# Altium schematic sheet FDC.SchDoc
size A3; SheetNumber: 5; SheetTotal: 15
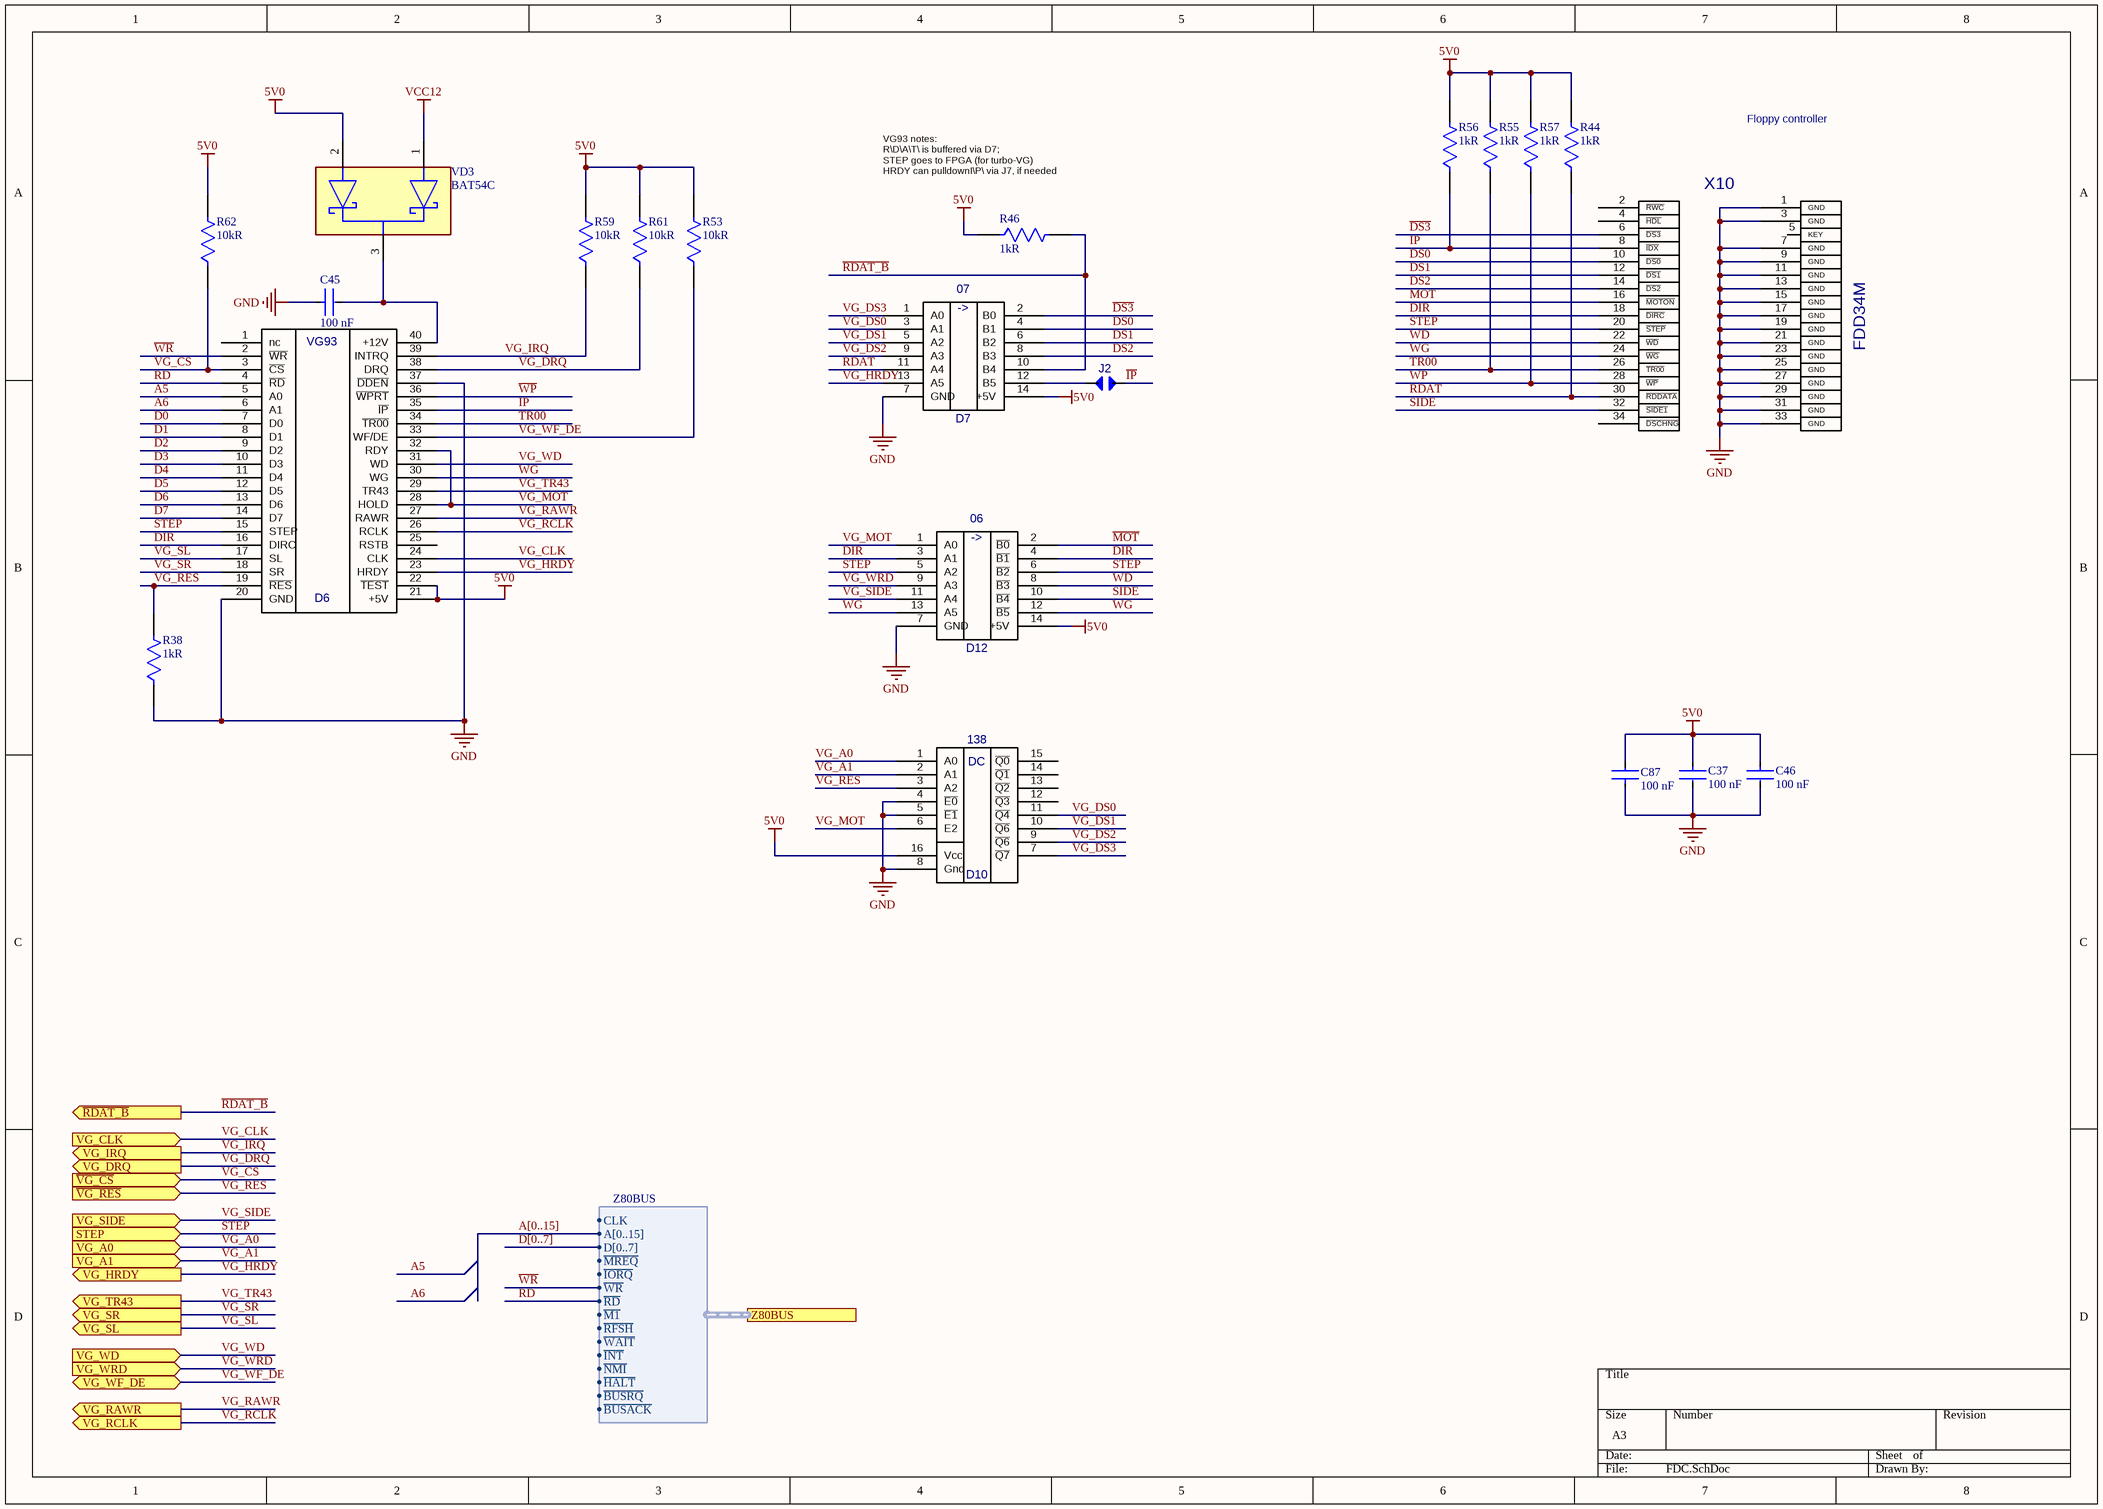
[diagram p0: FDC.SchDoc]

## Parts
C37  Capacitance: 100 nF  [FP-CC0805-0_85-IPC_A]  (hidden comment: CC0805KRX7R9BB104)
C45  Capacitance: 100 nF  [FP-CC0805-0_85-IPC_A]  (hidden comment: CC0805KRX7R9BB104)
C46  Capacitance: 100 nF  [FP-CC0805-0_85-IPC_A]  (hidden comment: CC0805KRX7R9BB104)
C87  Capacitance: 100 nF  [FP-CC0805-0_85-IPC_A]  (hidden comment: CC0805KRX7R9BB104)
D6  KR1818VG93  [DIP40]  (value not drawn)
D7  07  [SO14]
D10  138  [SO16]
D12  06  [SO14]
J2  JUMPER  [JUMPER_JUMPER(Primary)]  (value not drawn)
R38  Resistance: 1kR  [FP-CRCW0805-HPe3-IPC_A]  (hidden comment: CRCW08051K00FKEAHP)
R44  Resistance: 1kR  [FP-CRCW0805-HPe3-IPC_A]  (hidden comment: CRCW08051K00FKEAHP)
R46  Resistance: 1kR  [FP-CRCW0805-HPe3-IPC_A]  (hidden comment: CRCW08051K00FKEAHP)
R53  Resistance: 10kR  [FP-CR0805-IPC_A]  (hidden comment: CR0805-JW-103ELF)
R55  Resistance: 1kR  [FP-CRCW0805-HPe3-IPC_A]  (hidden comment: CRCW08051K00FKEAHP)
R56  Resistance: 1kR  [FP-CRCW0805-HPe3-IPC_A]  (hidden comment: CRCW08051K00FKEAHP)
R57  Resistance: 1kR  [FP-CRCW0805-HPe3-IPC_A]  (hidden comment: CRCW08051K00FKEAHP)
R59  Resistance: 10kR  [FP-CR0805-IPC_A]  (hidden comment: CR0805-JW-103ELF)
R61  Resistance: 10kR  [FP-CR0805-IPC_A]  (hidden comment: CR0805-JW-103ELF)
R62  Resistance: 10kR  [FP-CR0805-IPC_A]  (hidden comment: CR0805-JW-103ELF)
VD3  BAT54C  [FP-MA03D-MFG]
X10  FDD34M  [FDD34M]

## Ports
STEP (in), VG_A0 (in), VG_A1 (in), VG_CLK (in), VG_DRQ (out), VG_HRDY (out), VG_IRQ (out), VG_RAWR (out), VG_RCLK (out), VG_SIDE (in), VG_SL (out), VG_SR (out), VG_TR43 (out), VG_WD (in), VG_WF_DE (bidir), VG_WRD (in), Z80BUS (harness Z80BUS), ~{RDAT_B} (out), ~{VG_CS} (in), ~{VG_RES} (in)

## Harnesses
Z80BUS: A[0..15], D[0..7], ~{MREQ}, ~{IORQ}, ~{WR}, ~{RD}, ~{M1}, ~{RFSH}, ~{WAIT}, ~{INT}, ~{NMI}, ~{HALT}, ~{BUSRQ}, ~{BUSACK}, CLK

## Nets
5V0: C37.1 C46.1 C87.2 D6.21(+5V) D6.22(~{TEST}) D7.14(+5V) D10.16(Vcc) D12.14(+5V) R44.2 R46.1 R53.2 R55.2 R56.2 R57.2 R59.2 R61.2 R62.2 VD3.2(2_ANODE)
GND: C37.2 C45.1 C46.2 C87.1 D6.20(GND) D6.37(~{DDEN}) D7.7(GND) D10.4(~{E0}) D10.5(~{E1}) D10.8(Gnd) D12.7(GND) R38.1 X10.1(GND) X10.3(GND) X10.7(GND) X10.9(GND) X10.11(GND) X10.13(GND) X10.15(GND) X10.17(GND) X10.19(GND) X10.21(GND) X10.23(GND) X10.25(GND) X10.27(GND) X10.29(GND) X10.31(GND) X10.33(GND)
VCC12: VD3.1(1_ANODE)
A5: D6.5(A0)
A6: D6.6(A1)
D0: D6.7(D0)
D1: D6.8(D1)
D2: D6.9(D2)
D3: D6.10(D3)
D4: D6.11(D4)
D5: D6.12(D5)
D6: D6.13(D6)
D7: D6.14(D7)
~{DIR}: D12.4(~{B1}) X10.18(~{DIRC})
~{DS0}: D7.4(B1) X10.10(~{DS0})
~{DS1}: D7.6(B2) X10.12(~{DS1})
~{DS2}: D7.8(B3) X10.14(~{DS2})
~{DS3}: D7.2(B0) X10.6(~{DS3})
DIR: D6.16(DIRC) D12.3(A1)
~{IP}: D6.35(~{IP}) J2.1 R56.1 X10.8(~{IDX})
~{MOT}: D12.2(~{B0}) X10.16(~{MOTON})
~{RD}: D6.4(~{RD}) ; port Z80BUS.~{RD}
~{RDAT}: D7.11(A4) R44.1 X10.30(~{RDDATA})
~{RDAT_B}: D7.10(B4) R46.2 ; port ~{RDAT_B}
~{SIDE}: D12.10(~{B4}) X10.32(~{SIDE1})
~{STEP}: D12.6(~{B2}) X10.20(~{STEP})
STEP: D6.15(STEP) D12.5(A2) ; port STEP
~{TR00}: D6.34(~{TR00}) R55.1 X10.26(~{TR00})
~{VG_CS}: D6.3(~{CS}) R62.1 ; port ~{VG_CS}
~{VG_RES}: D6.19(~{RES}) D10.3(A2) R38.2 ; port ~{VG_RES}
VG_A0: D10.1(A0) ; port VG_A0
VG_A1: D10.2(A1) ; port VG_A1
VG_CLK: D6.24(CLK) ; port VG_CLK
VG_DRQ: D6.38(DRQ) R61.1 ; port VG_DRQ
VG_DS0: D7.3(A1) D10.11(~{Q4})
VG_DS1: D7.5(A2) D10.10(~{Q6})
VG_DS2: D7.9(A3) D10.9(~{Q6})
VG_DS3: D7.1(A0) D10.7(~{Q7})
VG_HRDY: D6.23(HRDY) D7.13(A5) ; port VG_HRDY
VG_IRQ: D6.39(INTRQ) R59.1 ; port VG_IRQ
VG_MOT: D6.28(HOLD) D6.32(RDY) D10.6(E2) D12.1(A0)
VG_RAWR: D6.27(RAWR) ; port VG_RAWR
VG_RCLK: D6.26(RCLK) ; port VG_RCLK
VG_SIDE: D12.11(A4) ; port VG_SIDE
VG_SL: D6.17(SL) ; port VG_SL
VG_SR: D6.18(SR) ; port VG_SR
VG_TR43: D6.29(TR43) ; port VG_TR43
VG_WD: D6.31(WD) ; port VG_WD
VG_WF_DE: D6.33(WF/DE) R53.1 ; port VG_WF_DE
VG_WRD: D12.9(A3) ; port VG_WRD
~{WD}: D12.8(~{B3}) X10.22(~{WD})
~{WG}: D12.12(~{B5}) X10.24(~{WG})
~{WP}: D6.36(~{WPRT}) R57.1 X10.28(~{WP})
~{WR}: D6.2(~{WR}) ; port Z80BUS.~{WR}
WG: D6.30(WG) D12.13(A5)
NetC45_2: C45.2 D6.40(+12V) VD3.3(COMMON_CATHODE)
NetD7_12: D7.12(B5) J2.0

Not connected (* = marked no-connect by the designer): D6 1(nc) 25(RSTB); D10 12(~{Q3}) 13(~{Q2}) 14(~{Q1}) 15(~{Q0}); X10 2(~{RWC}) 4(~{HDL}) 5(KEY) 34(~{DSCHNG})

## Buses and harness runs
bus A[0..15]
bus D[0..7]

## Notes on the sheet
- Floppy controller
- (near R46) VG93 notes:
  R\D\A\T\ is buffered via D7;
  STEP goes to FPGA (for turbo-VG)
  HRDY can pulldownI\P\ via J7, if needed
- (in symbol 06) ->
- (in symbol 07) ->
- (in symbol 138) DC
- (in symbol KR1818VG93) VG93

## Library data of the parts
C37 C45 C46 C87 = CMP-2100-03606-3: CAP CER 0.1UF 50V X7R 0805; Manufacturer: Yageo; Value: 100 nF; Manufacturer Part Number: CC0805KRX7R9BB104; Category: Cap; Case/Package: 0805
D7 = 07: Value: 74HCT07; Case/Package: SOIC-14; Category: IC
D10 = 138: value: 74HCT138; Case/Package: SOIC-16; Category: IC
D12 = 06: Value: 74HCT06; Case/Package: SOIC-14; Category: IC
J2 = JUMPER: HLT->~IP; Value: PLS-2; Case/Package: PLS-2; Category: Connector
R38 R44 R46 R55-R57 = CMP-02407-004529-1: RES Thick Film, 1kΩ, 1%, 0.5W, 100ppm/°C, 0805; Manufacturer: Vishay Dale; Case/Package: 0805; Number of Pins: 2; Termination: Solder; Manufacturer Part Number: CRCW08051K00FKEAHP; value: 1kΩ; Category: Res
R53 R59 R61 R62 = CMP-07231-003873-1: Thick Film Chip Resistors 0805 10kΩ 0.125W 5% 200ppm/°C; Manufacturer: Bourns; value: 10kΩ; Manufacturer Part Number: CR0805-JW-103ELF; Number of Terminations: 2; Termination: SMD/SMT; Number of Pins: 2; Case/Package: 0805; Category: Res
VD3 = CMP-07162-000010-1: DIODE ARRAY SCHOTTKY 30V SOT23-3; Manufacturer: ON Semiconductor / Fairchild; Capacitance: 10pF; Category: Diode; Manufacturer Part Number: BAT54C; Value: BAT54C; Case/Package: SOT-23
X10 = FDD34M: Value: Shrouded Header 34 pos 2.54mm 2 row; Case/Package: IDC-34; Category: Connector
D6 = KR1818VG93: Value: KR1818VG93; Case/Package: DIP-40; Category: IC